# Altium schematic sheet 3Dheater3.SchDoc
size A4
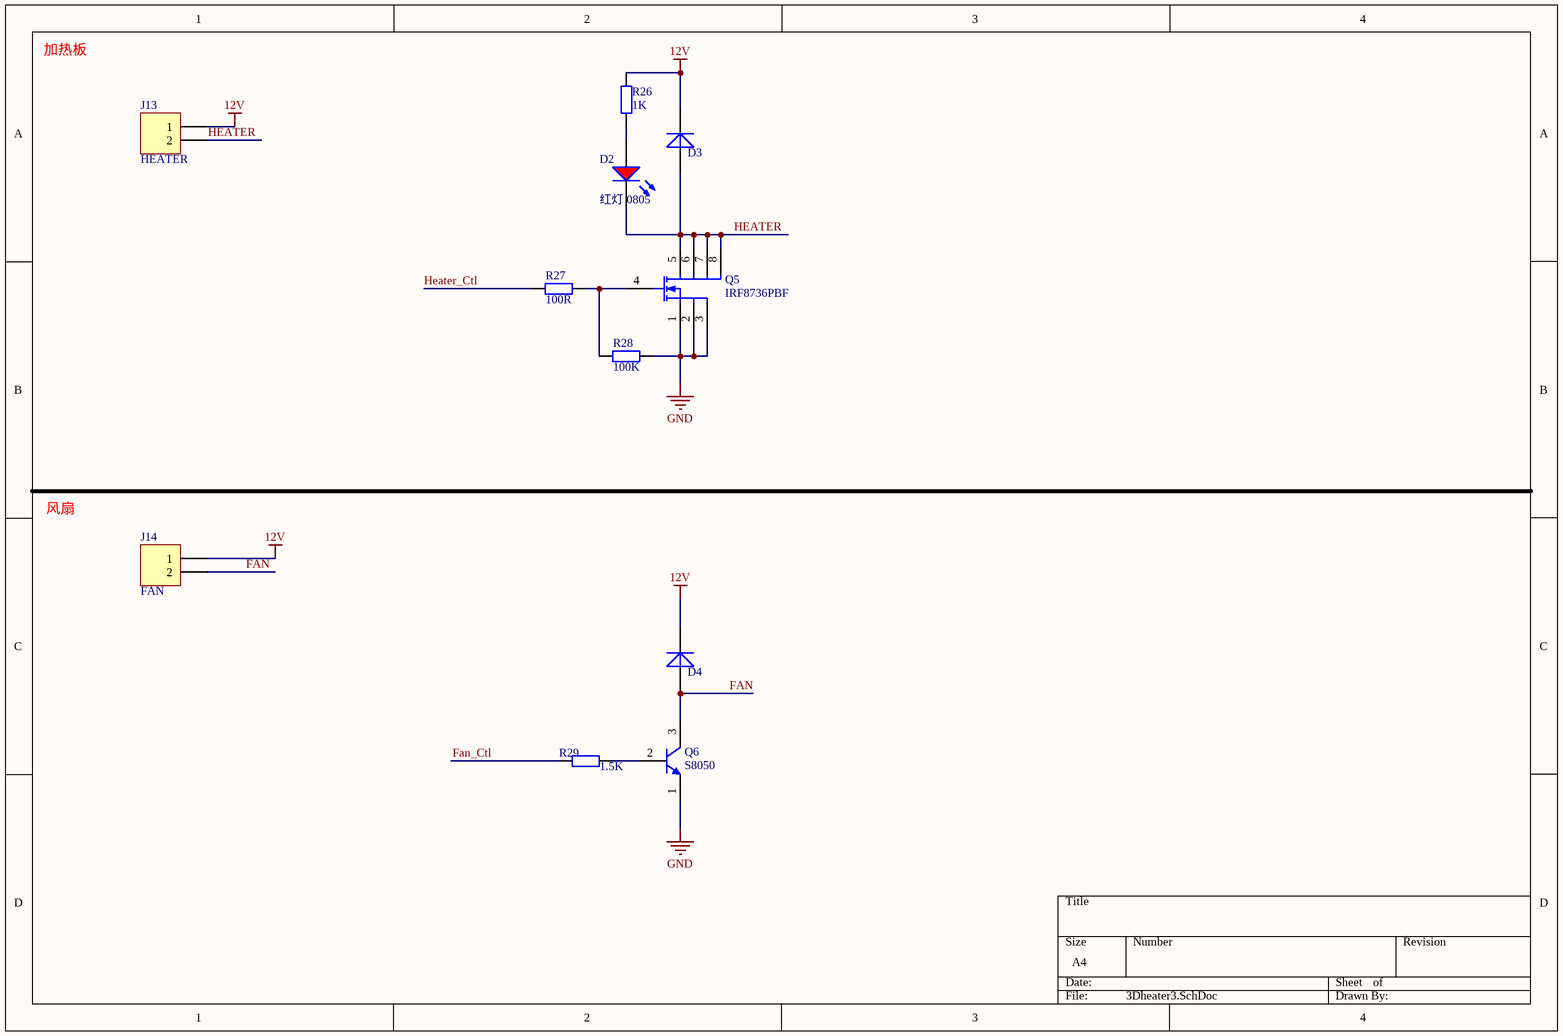
[diagram p0: 3Dheater3.SchDoc]

## Parts
D2  红灯 0805  [0805_LED_S1]
D3  S1G  [DO214AC (SMA)]  (value not drawn)
D4  S1G  [DO214AC (SMA)]  (value not drawn)
J13  HEATER  [HDR1X2]
J14  FAN  [HDR1X2]
Q5  IRF8736PBF  [SOIC127P600X175-8N (SO8)]
Q6  S8050  [SOT-23-3L]
R26  1K  [R0805]
R27  100R  [R0805]
R28  100K  [R0805]
R29  1.5K  [R0805]

## Nets
12V: D3.2(K) D4.2(K) J13.1 J14.1 R26.2
GND: Q5.1(S) Q5.2(S) Q5.3(S) Q6.1(E) R28.2
FAN: D4.1(A) J14.2 Q6.3(C)
Fan_Ctl: R29.2
HEATER: D2.K D3.1(A) J13.2 Q5.5(D) Q5.6(D) Q5.7(D) Q5.8(D)
Heater_Ctl: R27.1
NetD2_A: D2.A R26.1
NetQ5_4: Q5.4(G) R27.2 R28.1
NetQ6_2: Q6.2(B) R29.1

## Notes on the sheet
- 加热板
- 风扇

## Library data of the parts
D2 = 0805 红灯: 发光二极管; ComponentLink1Description: 供应商链接; ComponentLink1URL: http://www.szlcsc.com/product/details_2668.html; Package: 0805; Supplier: LC; SuppliersPartNumber: C2295
D3 D4 = Library_DIO-0001: RO DIODE S1G DO-214AC; Faber ItemCode: 32284000; Info: Fast Rectifiers 1A 400V; ID: Library_DIO-0001; Value: S1G
J13 J14 = Header 2H: Header, 2-Pin, Right Angle; LatestRevisionDate: 17-Jul-2002; LatestRevisionNote: Re-released for DXP Platform.; Publisher: Altium Limited
Q5 = LIBRARY_FET-0002: IRF8736PBF - MOSFET, N SO-8; Mfg: INTERNATIONAL RECTIFIER; Info: HEXFET Power MOSFET; Faber ItemCode: 36926000; Mfg code: IRF8736PBF; ID: LIBRARY_FET-0002; Value: IRF8736PBF
Q6 = S8050: NPN三极管; Published: 8-Jun-2000; LatestRevisionDate: 15-Jan-2003; LatestRevisionNote: PCB Footprint 'BCY-W3/D4.7' replaced; DatasheetDocument: 1997; PackageDocument: Sep-1998; PackageReference: TO-92A; Publisher: Altium Limited; Code_JEDEC: TO-92A; ComponentLink1Description: Manufacturer Link; ComponentLink1URL: http://www.fairchildsemi.com/; ComponentLink2Description: Datasheet; ComponentLink2URL: http://www.fairchildsemi.com/ds/2N%2F2N3904.pdf
R26-R29 = Res1: 贴片电阻; Published: 8-Jun-2000; LatestRevisionDate: 17-Jul-2002; LatestRevisionNote: Re-released for DXP Platform.; PackageReference: AXIAL-0.4; Publisher: Altium Limited
  R26: Value: 1K
  R27: Value: 100R
  R28: Value: 100K
  R29: Value: 1.5K